# Altium project PCB_Project1.PrjPCB
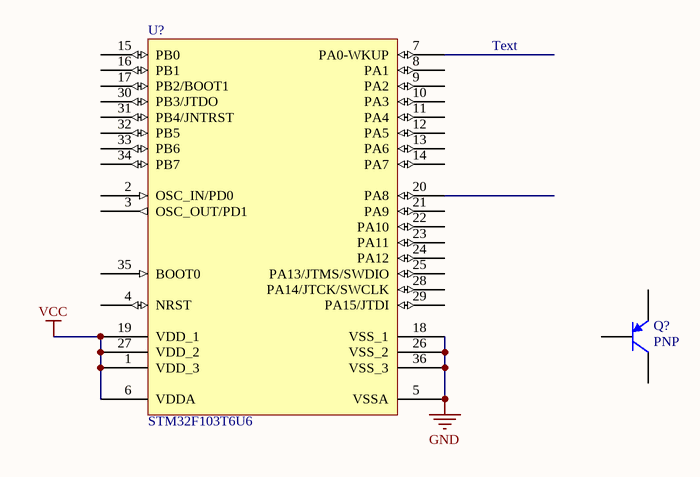
[diagram p0: Sheet1.SchDoc]
1 sheet, 2 parts. Net scope: global (net labels, ports and power ports of the same name join across sheets).
Board file: PCB1.PcbDoc

## Sheet Sheet1.SchDoc
size A

### Parts
Q?  PNP  [SOT-23B_N]
U?  STM32F103T6U6  [VFQN36_V]

### Nets
GND: U?.5(VSSA) U?.18(VSS_1) U?.26(VSS_2) U?.36(VSS_3)
VCC: U?.1(VDD_3) U?.6(VDDA) U?.19(VDD_1) U?.27(VDD_2)

Not connected (* = marked no-connect by the designer): Q? 1(C) 2(B) 3(E); U? 2(OSC_IN/PD0) 3(OSC_OUT/PD1) 4(NRST) 7(PA0-WKUP) 8(PA1) 9(PA2) 10(PA3) 11(PA4) 12(PA5) 13(PA6) 14(PA7) 15(PB0) 16(PB1) 17(PB2/BOOT1) 20(PA8) 21(PA9) 22(PA10) 23(PA11) 24(PA12) 25(PA13/JTMS/SWDIO) 28(PA14/JTCK/SWCLK) 29(PA15/JTDI) 30(PB3/JTDO) 31(PB4/JNTRST) 32(PB5) 33(PB6) 34(PB7) 35(BOOT0)

### Notes on the sheet
- Text

### Library data of the parts
Q? = PNP: PNP Bipolar Transistor; Published: 8-Jun-2000; LatestRevisionDate: 29-May-2009; LatestRevisionNote: IPC-7351 Footprint Added.; PackageVersion: Aug-1999; PackageReference: SOT-23B; Publisher: Altium Limited; PackageDescription: 3-Pin SOT-23 Package 0.95 mm Pitch, 2.4 mm Lead Span
U? = STM32F103T6U6: STM32 ARM-based 32-bit MCU with 32 Kbytes Flash, 36-pin VFQFPN, Industrial Temperature; Published: 30-May-2008; DatasheetVersion: rev6, Mar-2008; PackageVersion: Mar-2008; PackageReference: VFQN36; Publisher: Altium Limited; PackageDescription: 36-Pin Quad Flat No-Lead, 6 x 6 X 1.0 mm Body, 0.5 mm Pitch, Exposed Pad (VFQN36); ComponentLink1Description: Manufacturer Link; ComponentLink1URL: www.st.com/stm32; ComponentLink2Description: Datasheet; ComponentLink2URL: http://www.st.com/stonline/products/literature/ds/13587.pdf